# EAGLE design working (EAGLE 9.6.2)
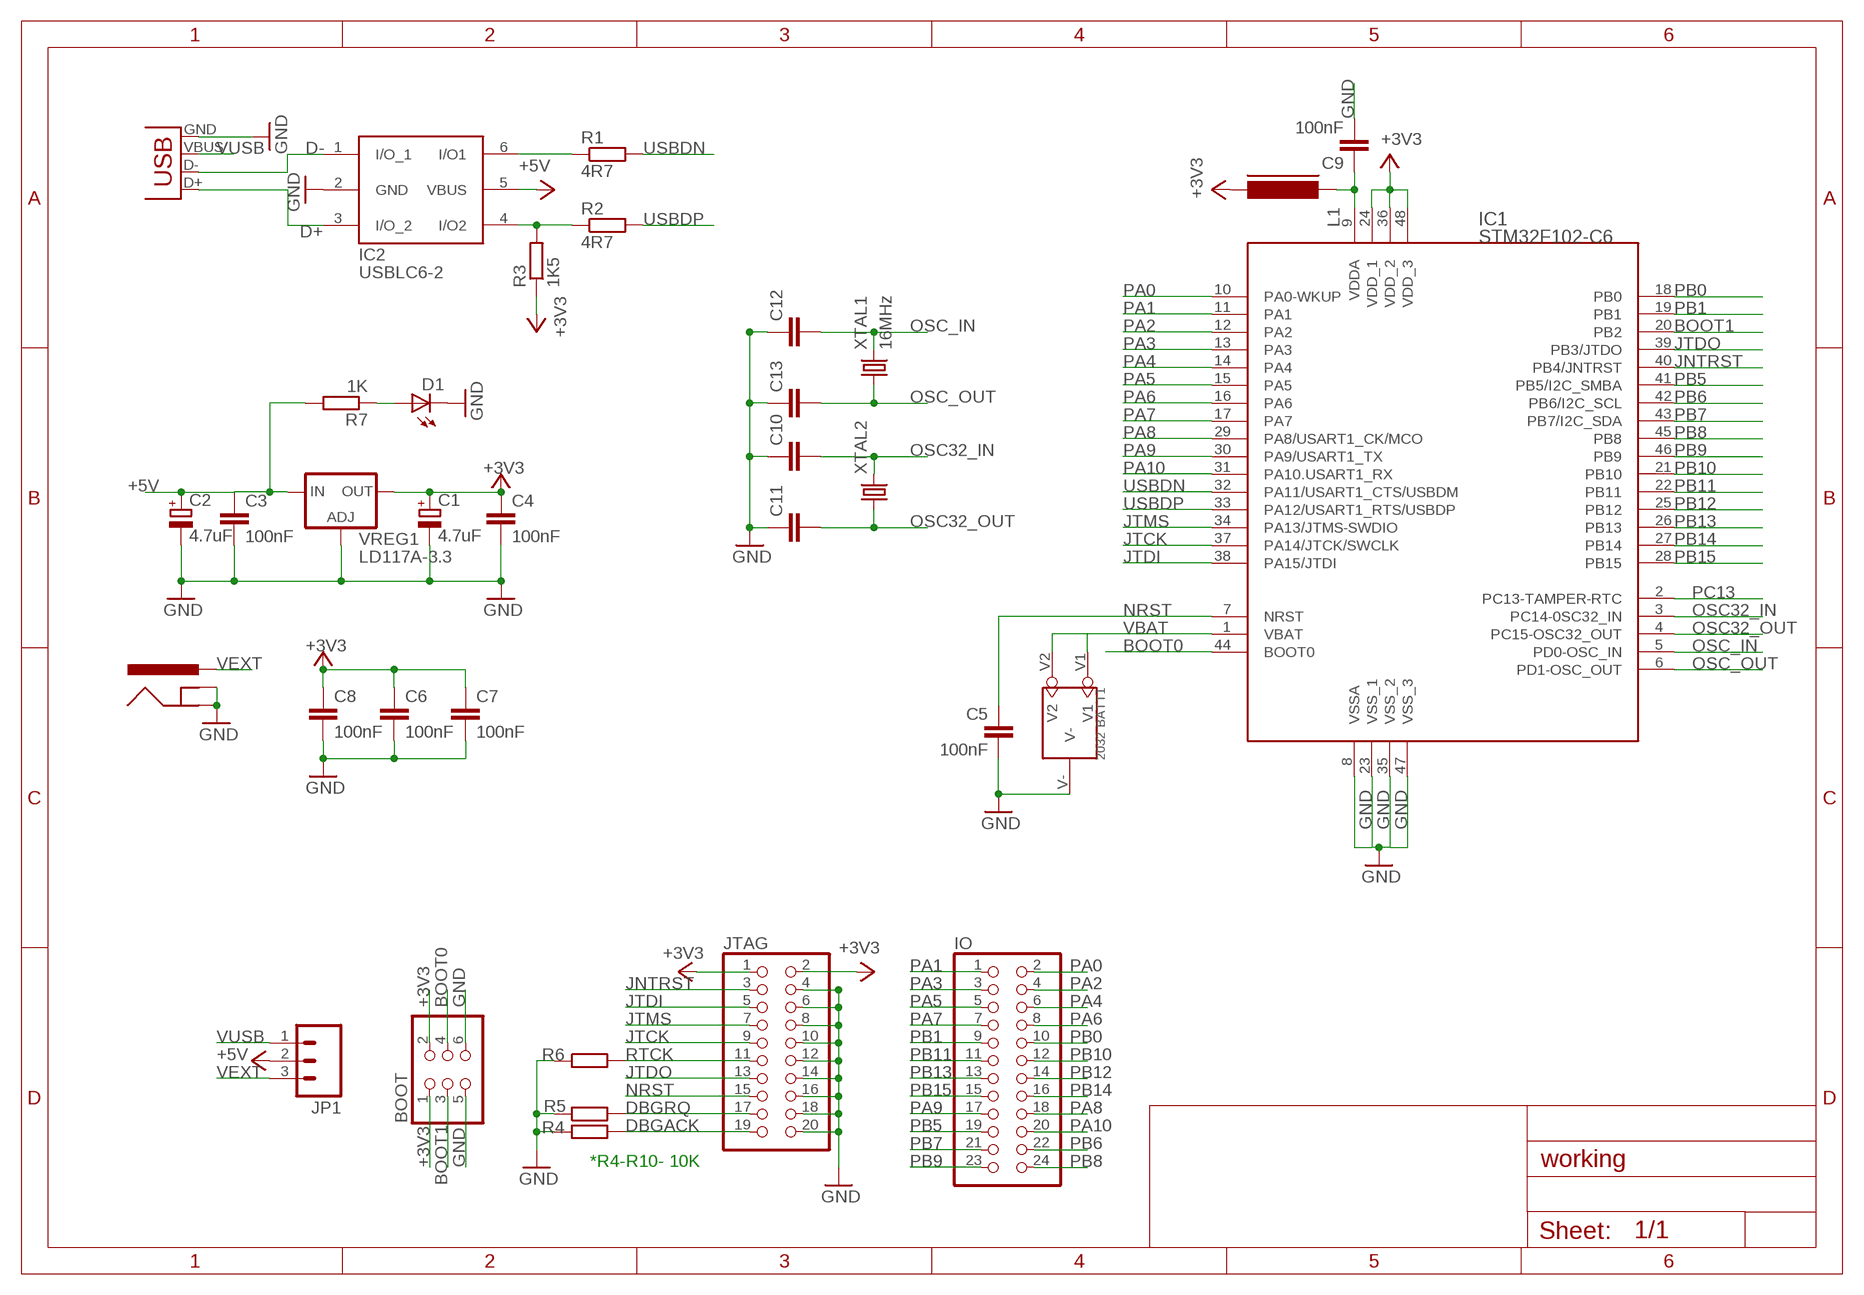
[diagram p0: schematic, sheet 1]

## Parts
BATT1  2032  [2032]
BOOT  PINHD-2X3  [2X03]
C1  4.7uF  CAP_POLSMC_A  [SMC_A]
C2  4.7uF  CAP_POLSMC_A  [SMC_A]
C3  100nF  C-EUC0805  [C0805]
C4  100nF  C-EUC0805  [C0805]
C5  100nF  C-EUC0805  [C0805]
C6  100nF  C-EUC0805  [C0805]
C7  100nF  C-EUC0805  [C0805]
C8  100nF  C-EUC0805  [C0805]
C9  100nF  C-EUC0805  [C0805]
C10  CAPC805  [C805]
C11  CAPC805  [C805]
C12  CAPC805  [C805]
C13  CAPC805  [C805]
D1  LEDCHIPLED_0805  [CHIPLED_0805]
IC1  STM32F102-C6  STM32  [LQFP48]
IC2  USBLC6-2  [SOT23-6L]
IO  PINHD-2X12  [2X12]
JP1  M03PTH  [1X03]
JTAG  PINHD-2X10  [2X10]
L1  FERRITE_BEAD805  [FB805]
R1  4R7  R-EU_R0805  [R0805]
R2  4R7  R-EU_R0805  [R0805]
R3  1K5  R-EU_R0805  [R0805]
R4  R-EU_R0805  [R0805]
R5  R-EU_R0805  [R0805]
R6  R-EU_R0805  [R0805]
R7  1K  R-EU_R0805  [R0805]
U$1  POWER_JACKSMD  [POWER_JACK_SMD]
USB  USBMINIB  [USB-MINIB]
VREG1  LD117A-3.3  LD117AS12TR  [SOT223]
XTAL1  16MHz  CRYSTALHC49UP  [HC49UP]
XTAL2  CRYSTALMM20SS  [MM20SS]

## Nets
+3V3: BOOT.1 BOOT.2 C1.+ C4.1 C6.1 C7.1 C8.1 IC1.24(VDD_1) IC1.36(VDD_2) IC1.48(VDD_3) JTAG.1 JTAG.2 L1.2 R3.1 VREG1.4(OUT)
+5V: C2.+ C3.1 IC2.5(VBUS) JP1.2 R7.2 VREG1.3(IN)
BOOT0: BOOT.4 IC1.44(BOOT0)
BOOT1: BOOT.3 IC1.20(PB2)
D+: IC2.3(I/O_2) USB.D+
D-: IC2.1(I/O_1) USB.D-
DBGACK: JTAG.19 R4.2
DBGRQ: JTAG.17 R5.2
GND: BATT1.V- BOOT.5 BOOT.6 C1.- C2.- C3.2 C4.2 C5.2 C6.2 C7.2 C8.2 C9.2 C10.1 C11.1 C12.1 C13.1 D1.C IC1.8(VSSA) IC1.23(VSS_1) IC1.35(VSS_2) IC1.47(VSS_3) IC2.2(GND) JTAG.4 JTAG.6 JTAG.8 JTAG.10 JTAG.12 JTAG.14 JTAG.16 JTAG.18 JTAG.20 R4.1 R5.1 R6.1 U$1.GND U$1.P$4(GND) USB.GND VREG1.1(ADJ)
JNTRST: IC1.40(PB4/JNTRST) JTAG.3
JTCK: IC1.37(PA14/JTCK/SWCLK) JTAG.9
JTDI: IC1.38(PA15/JTDI) JTAG.5
JTDO: IC1.39(PB3/JTDO) JTAG.13
JTMS: IC1.34(PA13/JTMS-SWDIO) JTAG.7
N$1: D1.A R7.1
N$2: IC2.6(I/O1) R1.1
N$3: IC2.4(I/O2) R2.1 R3.2
N$7: C9.1 IC1.9(VDDA) L1.1
NRST: C5.1 IC1.7(NRST) JTAG.15
OSC32_IN: C10.2 IC1.3(PC14-0SC32_IN) XTAL2.4
OSC32_OUT: C11.2 IC1.4(PC15-OSC32_OUT) XTAL2.1
OSC_IN: C12.2 IC1.5(PD0-OSC_IN) XTAL1.2
OSC_OUT: C13.2 IC1.6(PD1-OSC_OUT) XTAL1.1
PA0: IC1.10(PA0-WKUP) IO.2
PA1: IC1.11(PA1) IO.1
PA2: IC1.12(PA2) IO.4
PA3: IC1.13(PA3) IO.3
PA4: IC1.14(PA4) IO.6
PA5: IC1.15(PA5) IO.5
PA6: IC1.16(PA6) IO.8
PA7: IC1.17(PA7) IO.7
PA8: IC1.29(PA8/USART1_CK/MCO) IO.18
PA9: IC1.30(PA9/USART1_TX) IO.17
PA10: IC1.31(PA10.USART1_RX) IO.20
PB0: IC1.18(PB0) IO.10
PB1: IC1.19(PB1) IO.9
PB5: IC1.41(PB5/I2C_SMBA) IO.19
PB6: IC1.42(PB6/I2C_SCL) IO.22
PB7: IC1.43(PB7/I2C_SDA) IO.21
PB8: IC1.45(PB8) IO.24
PB9: IC1.46(PB9) IO.23
PB10: IC1.21(PB10) IO.12
PB11: IC1.22(PB11) IO.11
PB12: IC1.25(PB12) IO.14
PB13: IC1.26(PB13) IO.13
PB14: IC1.27(PB14) IO.16
PB15: IC1.28(PB15) IO.15
PC13: IC1.2(PC13-TAMPER-RTC)
RTCK: JTAG.11 R6.2
USBDN: IC1.32(PA11/USART1_CTS/USBDM) R1.2
USBDP: IC1.33(PA12/USART1_RTS/USBDP) R2.2
VBAT: BATT1.V1 BATT1.V2 IC1.1(VBAT)
VEXT: JP1.3 U$1.VIN0(PWR)
VUSB: JP1.1 USB.VBUS

## Notes on the sheet
- *R4-R10- 10K

## Library data of the parts
BATT1 = BAT:2032
BOOT = pinhead:PINHD-2X3: PIN HEADER
C1 C2 = library3:CAP_POL
C3-C9 = rcl:C-EU: CAPACITOR, European symbol
C10-C13 = library3:CAP
D1 = led:LED: LED OSRAM: - CHIPLED LG R971, LG N971, LY N971, LG Q971, LY Q971, LO R971, LY R971 LH N974, LH R974 LS Q976, LO Q976, LY Q976 LO Q996 - Hyper CHIPLED LW Q18S LB Q993, LB Q99A, LB R99A - SideLED LS A670, LO A670, LY A670, LG A670, LP A670 LB A673, LV A673, LT A673, LW A673 LH A674 LY A675 LS A676, LA A676, LO A676, LY A676, LW A676 LS A679, LY A679, LG A679 - Hyper Micro SIDELED® LS Y876, LA Y876, LO Y876, LY Y876 LT Y87S - SmartLED LW L88C, LW L88S LB L89C, LB L89S, LG L890 LS L89K, LO L89K, LY L89K LS L896, LA L896, LO L896, LY L896 - TOPLED LS T670, LO T670, LY T670, LG T670, LP T670 LSG T670, LSP T670, LSY T670, LOP T670, LYG T670 LG T671, LOG T671, LSG T671 LB T673, LV T673, LT T673, LW T673 LH T674 LS T676, LA T676, LO T676, LY T676, LB T676, LH T676, LSB T676, LW T676 LB T67C, LV T67C, LT T67C, LS T67K, LO T67K, LY T67K, LW E67C LS E67B, LA E67B, LO E67B, LY E67B, LB E67C, LV E67C, LT E67C LW T67C LS T679, LY T679, LG T679 LS T770, LO T770, LY T770, LG T770, LP T770 LB T773, LV T773, LT T773, LW T773 LH T774 LS E675, LA E675, LY E675, LS T675 LS T776, LA T776, LO T776, LY T776, LB T776 LHGB T686 LT T68C, LB T68C - Hyper Mini TOPLED® LB M676 - Mini TOPLED Santana® LG M470 LS M47K, LO M47K, LY M47K Source: http://www.osram.convergy.de LUXEON: - LUMILED® LXK2-PW12-R00, LXK2-PW12-S00, LXK2-PW14-U00, LXK2-PW14-V00 LXK2-PM12-R00, LXK2-PM12-S00, LXK2-PM14-U00 LXK2-PE12-Q00, LXK2-PE12-R00, LXK2-PE12-S00, LXK2-PE14-T00, LXK2-PE14-U00 LXK2-PB12-K00, LXK2-PB12-L00, LXK2-PB12-M00, LXK2-PB14-N00, LXK2-PB14-P00, LXK2-PB14-Q00 LXK2-PR12-L00, LXK2-PR12-M00, LXK2-PR14-Q00, LXK2-PR14-R00 LXK2-PD12-Q00, LXK2-PD12-R00, LXK2-PD12-S00 LXK2-PH12-R00, LXK2-PH12-S00 LXK2-PL12-P00, LXK2-PL12-Q00, LXK2-PL12-R00 Source: www.luxeon.com KINGBRIGHT: KA-3528ASYC Source: www.kingbright.com
IC1 = library3:STM32: STM32F102C6
IC2 = library3:USBLC6-2
IO = pinhead:PINHD-2X12: PIN HEADER
JP1 = SparkFun-3-2-07:M03: Header 3 Standard 3-pin 0.1" header. Use with straight break away headers (SKU : PType-HD), right angle break away headers (PType-HD-RightAngle), swiss pins (PType-30F), machine pins (PType-MP), and female headers (PType-FH). Molex polarized connector foot print use with SKU : Con-Hdr with associated crimp pins and housings.
JTAG = pinhead:PINHD-2X10: PIN HEADER
L1 = library3:FERRITE_BEAD
R1-R7 = rcl:R-EU_: RESISTOR, European symbol
U$1 = SparkFun-3-2-07:POWER_JACK: Power Jack This is the standard 5.5mm barrel jack for power. The PTH is the most common, proven, reliable, footprint. All others are experimental. The Slot footprint only works if the mill layer is transmitted to the PCB fab house so be warned. Spark Fun Electronics SKU : PType-BPJ. Mating wall wart : Tools-PS
USB = SparkFun-3-2-07:USB: USB Connectors USB-B-PTH is fully proven SKU : PType-USB-B USB-miniB is fully proven SKU : PType-USB-miniB USB-A-H is throughly reviewed, but untested. Spark Fun Electronics SKU : PType-USB-A USB-B-SMT is throughly reviewed, but untested. Needs silkscreen touching up. USB-A-S has not been used/tested USB-MB-H has not been used/tested
VREG1 = v-reg:LD117A?*: Low drop fixed and adjustable positive voltage regulators 1 A Source: http://www.st.com/stonline/products/literature/ds/7194/ld1117axx.pdf
XTAL1 XTAL2 = crystal:CRYSTAL: CRYSTAL

## Board
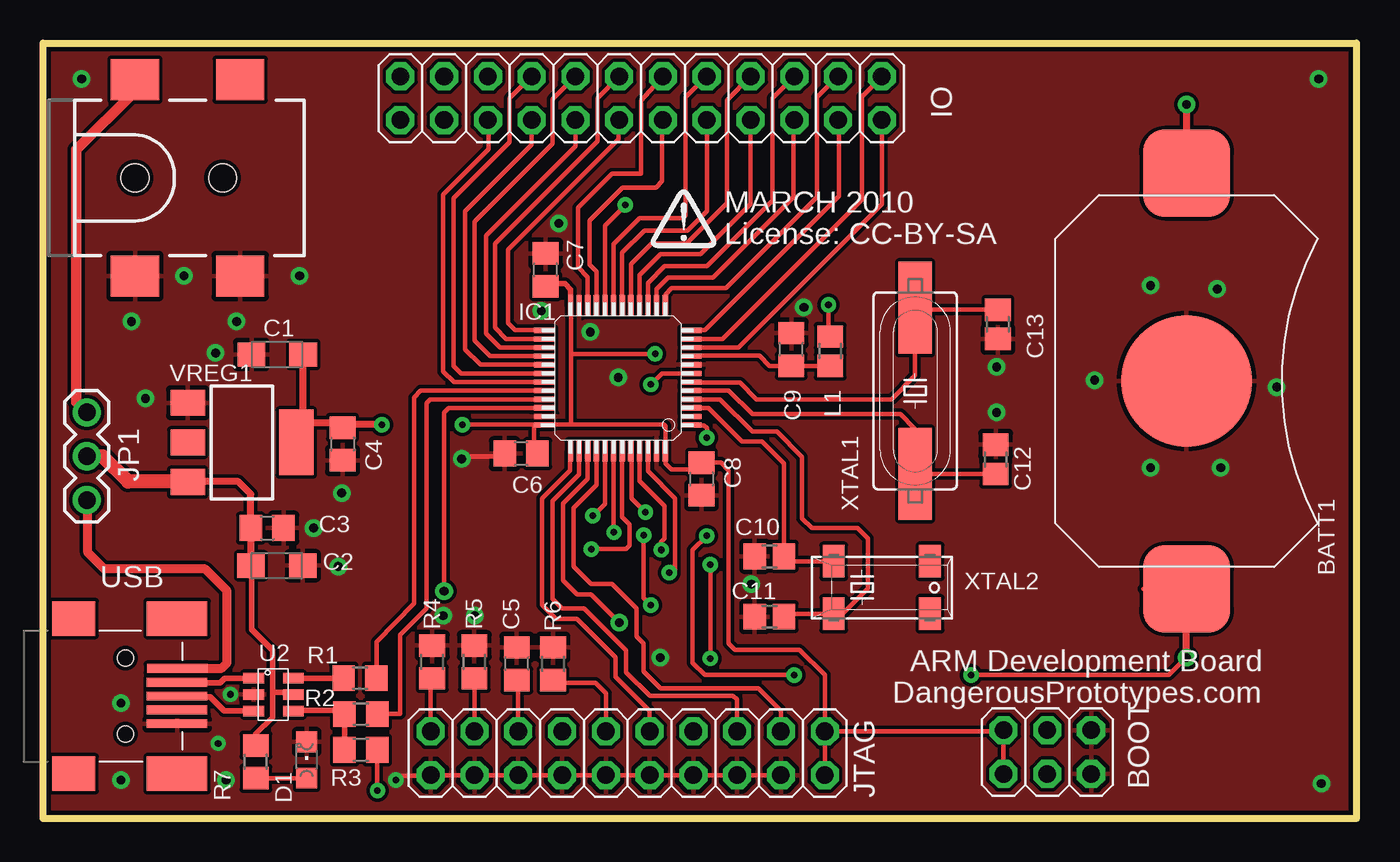
[diagram p1: board, top side]
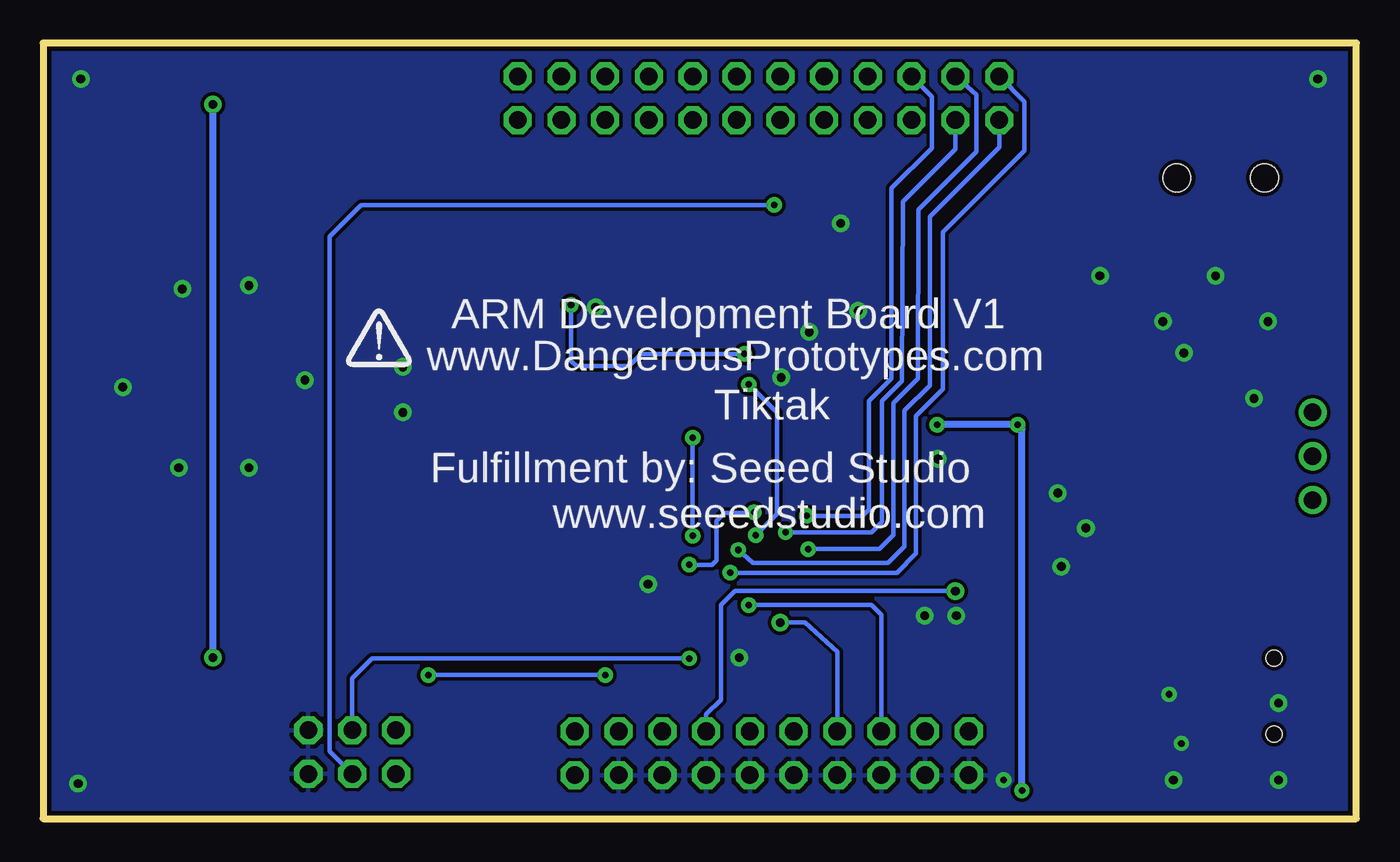
[diagram p2: board, bottom side, seen from below]

Size 76.2 x 45.01 mm. Coordinates in mm from the lower left corner, seen from the top.
Outline: 0,0 0,45.01 76.2,45.01 76.2,0 0,0
Copper layers (1*16): Top 0.035mm / dielectric 1.5mm / Bottom 0.035mm
Design rules "SparkFun": minimum track width 8mil, minimum drill 20mil, track to track 8mil, track to pad 8mil, pad to pad 8mil, via to via 8mil, smd to smd 8mil, copper to edge 10mil, drill to drill 8mil, minimum pad ring 12mil, minimum via ring 10mil, stop-mask expansion 4mil, vias tented up to drill 25mil, thermal gap 10mil

### Footprints (pad centres in the part's own frame; a part is rotated, then mirrored left to right if it is on the bottom)
2032 = smd 5.08 x 5.08: V1 -12.065,0; V2 12.065,0 | smd 7.62 x 7.62: V- 0,0
2X03 = drill 1.016 octagon: 1 -2.54,-1.27; 2 -2.54,1.27; 3 0,-1.27; 4 0,1.27; 5 2.54,-1.27; 6 2.54,1.27
SMC_A = smd 1.6 x 1.4: + -1.5,0; - 1.5,0
C0805 = smd 1.3 x 1.5: 1 -0.95,0; 2 0.95,0
C805 = smd 1.3 x 1.5: 1 -0.85,0; 2 0.85,0
CHIPLED_0805 = smd 1.2 x 1.2: A 0,-1.05; C 0,1.05
LQFP48 = smd 0.3 x 1.2: 1 -2.75,-4.25; 2 -2.25,-4.25; 3 -1.75,-4.25; 4 -1.25,-4.25; 5 -0.75,-4.25; 6 -0.25,-4.25; 7 0.25,-4.25; 8 0.75,-4.25; 9 1.25,-4.25; 10 1.75,-4.25; 11 2.25,-4.25; 12 2.75,-4.25; 25 2.75,4.25; 26 2.25,4.25; 27 1.75,4.25; 28 1.25,4.25; 29 0.75,4.25; 30 0.25,4.25; 31 -0.25,4.25; 32 -0.75,4.25; 33 -1.25,4.25; 34 -1.75,4.25; 35 -2.25,4.25; 36 -2.75,4.25 | smd 1.2 x 0.3: 13 4.2,-2.75; 14 4.2,-2.25; 15 4.2,-1.75; 16 4.2,-1.25; 17 4.2,-0.75; 18 4.2,-0.25; 19 4.2,0.25; 20 4.2,0.75; 21 4.2,1.25; 22 4.2,1.75; 23 4.2,2.25; 24 4.2,2.75; 37 -4.25,2.75; 38 -4.25,2.25; 39 -4.25,1.75; 40 -4.25,1.25; 41 -4.25,0.75; 42 -4.25,0.25; 43 -4.25,-0.25; 44 -4.25,-0.75; 45 -4.25,-1.25; 46 -4.25,-1.75; 47 -4.25,-2.25; 48 -4.25,-2.75
SOT23-6L = smd 0.6 x 1.2: 1 -0.95,-2.3; 2 0,-2.3; 3 0.95,-2.3; 4 0.95,0; 5 0,0; 6 -0.95,0
2X12 = drill 1.016 octagon: 1 -13.97,-1.27; 2 -13.97,1.27; 3 -11.43,-1.27; 4 -11.43,1.27; 5 -8.89,-1.27; 6 -8.89,1.27; 7 -6.35,-1.27; 8 -6.35,1.27; 9 -3.81,-1.27; 10 -3.81,1.27; 11 -1.27,-1.27; 12 -1.27,1.27; 13 1.27,-1.27; 14 1.27,1.27; 15 3.81,-1.27; 16 3.81,1.27; 17 6.35,-1.27; 18 6.35,1.27; 19 8.89,-1.27; 20 8.89,1.27; 21 11.43,-1.27; 22 11.43,1.27; 23 13.97,-1.27; 24 13.97,1.27
1X03 = drill 1.016: 1 0,0; 2 2.54,0; 3 5.08,0
2X10 = drill 1.016 octagon: 1 -11.43,-1.27; 2 -11.43,1.27; 3 -8.89,-1.27; 4 -8.89,1.27; 5 -6.35,-1.27; 6 -6.35,1.27; 7 -3.81,-1.27; 8 -3.81,1.27; 9 -1.27,-1.27; 10 -1.27,1.27; 11 1.27,-1.27; 12 1.27,1.27; 13 3.81,-1.27; 14 3.81,1.27; 15 6.35,-1.27; 16 6.35,1.27; 17 8.89,-1.27; 18 8.89,1.27; 19 11.43,-1.27; 20 11.43,1.27
FB805 = smd 1.3 x 1.5: 1 -0.85,0; 2 0.85,0
R0805 = smd 1.3 x 1.5: 1 -0.95,0; 2 0.95,0
POWER_JACK_SMD = smd 2.8 x 2.4: GND 0,-5.7; P$4 6.1,-5.7; VIN0 0,5.7; VIN1 6.1,5.7 | hole 1.6: 0,0; 5.08,0
USB-MINIB = smd 2.5 x 2: 1 -3,-4.5; 2 -3,4.5 | smd 3.5 x 2: 3 3,-4.5; 4 3,4.5 | smd 3.5 x 0.5: D+ 3,0; D- 3,0.8; GND 3,-1.6; ID 3,-0.8; VBUS 3.01,1.61 | hole 0.9: 0,2.2; 0,-2.2
SOT223 = smd 1.5 x 2: 1 -2.3,-3.15; 2 0,-3.15; 3 2.3,-3.15 | smd 3.8 x 2: 4 0,3.15
HC49UP = smd 5.334 x 1.93: 1 -4.826,0; 2 4.826,0
MM20SS = smd 1.27 x 1.88: 1 -2.794,-1.524; 2 2.794,-1.524; 3 2.794,1.524; 4 -2.794,1.524

### Placement (x,y rotation side)
BATT1  66.34,25.4 90 top
BOOT  58.27,3.86 0 top
C1  13.59,26.94 180 top
C2  13.56,14.68 0 top
C3  13,16.87 0 top
C4  17.37,21.74 270 top
C5  27.48,8.99 90 top
C6  27.74,21.18 180 top
C7  29.16,31.85 90 top
C8  38.2,19.71 270 top
C9  43.41,27.23 90 top
C10  42.14,15.23 0 top
C11  42.14,11.72 0 top
C12  55.27,20.85 270 top
C13  55.4,28.69 90 top
D1  15.29,3.4 0 top
IC1  33.35,25.59 90 top
IC2  14.52,7.2 270 top
IO  34.7,41.81 180 top
JP1  2.54,18.49 90 top
JTAG  33.92,3.8 180 top
L1  45.67,27.13 90 top
R1  18.39,8.15 0 top
R2  18.44,6.07 0 top
R3  18.44,3.99 180 top
R4  22.58,9.09 270 top
R5  25.02,9.09 270 top
R6  29.59,8.99 270 top
R7  12.34,3.3 90 top
U$1  5.33,37.19 0 top
U$2  [DP-LOGO]  35.26,33.12 0 top
U$3  [DP-LOGO]  58.62,26.21 0 bottom
USB  4.78,7.11 0 top
VREG1  11.54,21.83 270 top
XTAL1  50.6,24.83 270 top
XTAL2  48.67,13.41 0 top

### Tracks (layer width: path | path; a pad name or v marks a point on that pad's centre or on a via)
+3V3  (via drill 0.38)
  Top 0.254: JTAG.1 JTAG.2 | BOOT.1 BOOT.2 arc90 55.69,5.07 JTAG.1 | JTAG.1 45.35,8.34 43.89,9.8 40.13,9.8 39.78,10.16 39.78,20.22 39.32,20.68 38.57,20.68 C8.1 arc-46 37.64,20.27 36.47,20.27 36.12,20.63 36.12,21.32 IC1.48 36.1,22.78 36.02,22.86 30.63,22.86 | v24.33,22.86 28.5,22.86 | 17.54,22.86 arc90 C4.1 | R3.1 19.39,2.07 19.41,2.05 v19.41,1.63 | 30.63,22.86 29.12,22.86 IC1.36 28.52,22.84 28.5,22.86 | IC1.24 30.63,29.76 30.63,26.98 | 30.63,22.86 30.63,26.98 | L1.2 45.57,28.08 v45.57,29.82 | 30.63,26.98 v35.51,26.98 | 28.5,22.86 28.5,21.37 C6.1
  Top 0.305: C7.1 29.3,31.04 30.28,31.04 30.6,30.72 IC1.24 | 14.94,22.96 14.96,22.1 15.09,22.23 | 16.76,22.96 17.78,22.96 17.98,22.76 17.44,22.76 C4.1
  Top 0.406: 14.96,22.1 VREG1.4 | 16.76,22.96 14.94,22.96 | 15.09,22.23 C1.+ | v19.66,22.86 17.54,22.86
  Bottom 0.254: 19.41,22.61 v19.66,22.86 | v45.57,29.82 45.57,26.57 45.26,26.26 42.21,26.26 41.5,26.98 v35.51,26.98
  Bottom 0.406: v19.66,22.86 v24.33,22.86 | v19.41,1.63 19.41,22.61
+5V
  Top 0.305: C2.+ 12.09,14.65 12.09,10.97 13.31,9.75 13.31,7.32 | 13.31,7.32 13.31,5.89 12.34,4.93 R7.2 | IC2.5 14.4,7.32 13.31,7.32
  Top 0.406: VREG1.3 8.42,19.56 11.33,19.56 12.05,18.83 C3.1 12.06,16.86 C2.+
  Top 0.813: VREG1.3 8.37,19.56 4.93,19.56 3.45,21.03 JP1.2
BOOT0  (via drill 0.38)
  Top 0.254: IC1.44 34.14,21.3 34.14,18.59 v34.95,17.78 | v38.71,9.3 v38.71,14.73
  Bottom 0.254: 58.27,5.03 BOOT.4 58.27,8.13 57.1,9.3 v38.71,9.3 | v34.95,17.78 35,17.73 36.68,17.73 37.13,17.27 37.13,14.99 37.39,14.73 v38.71,14.73
BOOT1  (via drill 0.38)
  Top 0.254: v33.78,35.61 32.6,34.43 IC1.20
  Bottom 0.254: BOOT.3 59.59,3.91 59.59,33.78 57.76,35.61 v33.78,35.61
D+
  Top 0.305: USB.D+ 7.83,7.06 9.7,7.06 10.51,6.25 IC2.3
D-
  Top 0.305: USB.D- 7.81,7.87 10.26,7.87 10.54,8.15 IC2.1
DBGACK
  Top 0.254: R4.2 22.49,8.05 JTAG.19
DBGRQ
  Top 0.254: R5.2 25.03,8.13 JTAG.17
GND  (via drill 0.38, 0.51)
  Top 0.254: IC1.23 31.12,29.82 | JTAG.4 JTAG.6 JTAG.8 JTAG.10 JTAG.12 JTAG.14 JTAG.16 JTAG.18 25.2,2.69 25.25,2.69 25.08,2.53 JTAG.20 22.45,2.49 20.73,2.49 v20.47,2.24 | C6.2 26.63,21.03 24.23,21.03 24.18,21.08 24.13,21.08
  Top 0.406: BATT1.V- 66.7,25.04
  other vias: 2.24,42.93 74.02,42.93 74.17,2.03 10.87,7.21 10.16,4.37 24.28,20.88 33.38,25.6 35.81,9.35 71.58,25.04 28.91,29.46 29.92,34.54 55.32,26.21 55.32,23.57 41.1,13.61 23.22,11.79 25.04,11.79 17.32,18.9 15.7,16.87 17.12,14.63 44.15,29.67 10.01,27.03 5.94,24.38 5.13,28.85 8.18,31.5 11.23,28.85 14.88,31.5 10.62,2.24 4.52,2.24 4.52,6.71 61.01,25.45 64.26,20.37 68.33,20.37 68.12,30.73 64.26,30.94 31.75,28.24
  pour Top: -0.81,45.11 76.25,45.11 75.84,-6.1 -1.17,-6.1
  pour Bottom: -0.56,45.16 76.35,45.16 75.95,-6.1 -0.97,-6.1
JNTRST
  Top 0.254: IC1.40 32.11,19.36 30.78,18.03 30.78,14.63 31.8,13.61 33.02,13.61 34.44,12.19 34.44,10.57 34.85,10.16 34.85,8.53 35.81,7.57 41.5,7.57 42.81,6.26 JTAG.3
JTCK
  Top 0.254: IC1.37 30.63,21.31 30.58,21.26 30.58,20.22 28.96,18.59 28.96,12.4 29.77,11.58 30.99,11.58 33.22,9.35 33.22,8.23 35.19,6.26 JTAG.9
JTDI
  Top 0.254: JTAG.5 40.27,6.92 40.03,7.11 35.2,7.11 33.83,8.48 33.83,9.75 31.39,12.19 30.12,12.19 29.57,12.75 29.57,18.44 31.09,19.96 31.09,21.33 IC1.38
JTDO  (via drill 0.51)
  Top 0.254: IC1.39 31.6,19.71 30.17,18.29 30.17,13.82 30.99,13.01 31.8,13.01 v33.43,11.38
  Bottom 0.254: v33.43,11.38 32,11.38 30.11,9.69 JTAG.13
JTMS  (via drill 0.51)
  Top 0.254: IC1.34 23.54,23.84 23.27,23.57 v23.27,13.21
  Bottom 0.254: v23.27,13.21 36.07,13.21 36.88,12.4 36.88,6.91 37.73,6.06 JTAG.7
N$1
  Top 0.254: R7.1 D1.A
N$2
  Top 0.305: IC2.6 R1.1
N$3
  Top 0.305: IC2.4 14.56,6.3 16.97,6.3 17.2,6.07 R2.1 R3.2
N$7
  Top 0.254: IC1.9 37.63,26.87 41.55,26.87 42.15,26.28 C9.1 L1.1
NRST  (via drill 0.38)
  Top 0.254: IC1.7 35.9,25.84 v35.25,25.2 | v34.85,16.46 34.85,12.8 v35.25,12.4 | JTAG.15 27.57,8.04 C5.1
  Bottom 0.254: v35.25,25.2 33.63,23.57 33.63,17.68 v34.85,16.46 | v35.25,12.4 28.14,12.4 27.57,11.82 JTAG.15
OSC32_IN
  Top 0.254: IC1.3 37.62,23.83 38.61,23.83 40.54,21.9 41.71,21.9 42.99,20.61 C10.2 | C10.2 43.03,15.19 | XTAL2.4 42.99,14.94 C10.2
OSC32_OUT
  Top 0.254: 42.62,11.63 C11.2 42.99,11.89 XTAL2.1 46.25,11.89 46.25,11.76 | IC1.4 39.27,24.33 41.15,22.45 42.57,22.45 44.04,20.98 44.04,17.42 44.6,16.87 47.24,16.87 47.85,16.26 47.85,13.36 46.25,11.76 | 46.25,11.76 46.13,11.63
OSC_IN
  Top 0.254: IC1.5 39.78,24.84 41.15,23.47 49.73,23.47 50.6,22.61 XTAL1.2 C12.2
OSC_OUT
  Top 0.254: IC1.6 37.64,25.3 40.44,25.3 41.4,24.33 49.22,24.33 50.6,25.71 XTAL1.1 50.71,29.54 C13.2
PA0
  Top 0.254: IO.2 48.67,35.66 40.34,27.34 IC1.10
PA1
  Top 0.254: IO.1 47.5,41.91 47.5,35.92 39.42,27.84 IC1.11
PA2
  Top 0.254: IO.4 46.18,40.49 46.18,36.12 38.4,28.35 IC1.12
PA3
  Top 0.254: IO.3 44.91,41.86 44.91,36.07 39.62,30.79 36.47,30.79 36.1,30.41 IC1.13
PA4
  Top 0.254: IO.6 43.54,40.49 43.54,36.07 38.86,31.39 36.27,31.39 35.6,30.72 IC1.14
PA5
  Top 0.254: IO.5 42.32,41.81 42.32,35.87 38.51,32.06 36.07,32.06 35.1,31.09 IC1.15
PA6
  Top 0.254: IO.8 41.05,35.66 38.15,32.77 35.81,32.77 34.6,31.55 IC1.16
PA7
  Top 0.254: IO.7 39.67,41.71 39.67,35.71 37.34,33.38 35.31,33.38 34.1,32.17 IC1.17
PA8
  Top 0.254: IO.18 28.35,39.12 24.49,35.26 24.49,27.23 25.37,26.34 IC1.29
PA9
  Top 0.254: IO.17 27.08,41.81 27.08,39.27 23.82,36.02 23.82,26.26 24.25,25.84 IC1.30
PA10
  Top 0.254: IO.20 25.86,40.49 25.86,38.86 23.22,36.22 23.22,25.96 23.83,25.34 IC1.31
PB0
  Top 0.254: IO.10 38.51,35.26 37.39,34.14 34.9,34.14 33.6,32.84 IC1.18
PB1
  Top 0.254: IO.9 37.29,41.86 37.29,35 37.13,34.85 34.59,34.85 33.1,33.35 IC1.19
PB5  (via drill 0.38)
  Top 0.254: 32.61,21.34 IC1.41 32.6,18.27 v31.9,17.58
  Bottom 0.254: IO.19 24.64,41.91 24.64,38.91 26.97,36.58 26.97,25.55 28.3,24.23 28.3,17.93 28.65,17.58 v31.9,17.58
PB6  (via drill 0.38)
  Top 0.254: v33.12,16.61 33.1,16.63 IC1.42
  Bottom 0.254: IO.22 23.27,38.86 26.31,35.81 26.36,25.4 27.53,24.23 27.53,17.22 28.14,16.61 v33.12,16.61
PB7  (via drill 0.38)
  Top 0.254: 31.85,15.6 v31.8,15.65 33.83,15.65 34.04,15.85 34.04,17.07 33.6,17.5 IC1.43
  Bottom 0.254: IO.21 22.05,42.01 22.05,38.71 25.4,35.36 25.45,25.55 26.87,24.13 26.87,16.46 27.69,15.65 v31.8,15.65
PB8  (via drill 0.38)
  Top 0.254: IC1.45 34.59,19.61 36.07,18.14 36.07,16.26 35.86,16.05 v35.86,15.6
  Bottom 0.254: v35.86,15.6 35,14.83 27.18,14.83 26.21,15.8 26.21,23.67 24.74,25.15 24.74,34.95 20.73,38.96 IO.24
PB9  (via drill 0.38)
  Top 0.254: IC1.46 35.1,20.17 36.68,18.59 36.68,14.28 v36.32,14.28
  Bottom 0.254: IO.23 19.25,41.61 19.25,38.76 23.98,34.04 23.98,24.94 25.55,23.37 25.55,15.39 26.67,14.28 v36.32,14.28
PB10
  Top 0.254: IO.12 35.92,40.49 35.92,36.98 35.56,36.63 33.63,36.63 31.7,34.7 31.7,32.16 32.1,31.76 IC1.21
PB11
  Top 0.254: IO.11 34.7,41.66 34.7,37.44 33.02,37.44 31.04,35.46 31.04,32 31.6,31.44 IC1.22
PB12
  Top 0.254: IO.14 33.38,40.49 33.38,39.42 26.97,33.02 26.97,28.75 27.39,28.34 IC1.25
PB13
  Top 0.254: IO.13 32.16,41.81 32.16,39.32 26.21,33.38 26.21,28.5 26.87,27.84 IC1.26
PB14
  Top 0.254: IO.16 30.89,39.01 25.7,33.83 25.7,28.14 26.51,27.34 IC1.27
PB15
  Top 0.254: IO.15 29.57,41.76 29.57,39.17 25.04,34.65 25.04,27.74 25.94,26.84 IC1.28
RTCK
  Top 0.254: R6.2 29.76,7.87 32.05,7.87 32.65,7.28 JTAG.11
USBDN
  Top 0.254: IC1.32 29,24.84 21.89,24.84 21.54,24.44 21.54,12.5 19.34,10.25 R1.2
USBDP
  Top 0.254: IC1.33 22.45,24.33 22.25,24.13 22.25,12.19 20.73,10.67 20.73,6.1 20.65,6.07 R2.2
VBAT  (via drill 0.38, 0.51)
  Top 0.254: IC1.1 37.63,22.81 38.35,22.81 38.51,22.66 v38.51,22.1 | v38.51,16.41 37.69,15.6 37.69,9.04 38.4,8.33 v43.59,8.33 | BATT1.V1 63.83,13.34 | v53.85,8.33 65.33,8.33 v66.34,9.35
  Top 0.406: 66.19,37.31 66.34,37.31 v66.34,41.45 | v66.34,9.35 BATT1.V1
  Top 0.61: 66.19,37.31 BATT1.V2
  Bottom 0.254: v38.51,16.41 v38.51,22.1 | v43.59,8.33 v53.85,8.33
  Bottom 0.406: v66.34,9.35 v66.34,41.45
VEXT
  Top 0.61: JP1.3 1.93,24.18 1.93,38.81 5.33,42.22 U$1.VIN0
VUSB
  Top 0.406: 2.59,18.44 JP1.1
  Top 0.508: USB.VBUS 10.35,8.72 10.67,9.04 10.67,13.21 9.4,14.48 3.56,14.48 2.59,15.44 2.59,18.44

### Text on the board
tNames: MARCH 2010 | License: CC-BY-SA | U2 | ARM Development Board | DangerousPrototypes.com
bNames: ARM Development Board V1 | www.DangerousPrototypes.com | Tiktak | Fulfillment by: Seeed Studio | www.seeedstudio.com